# EAGLE design PCM5102a_FG_Small_1 (EAGLE 7.2.0)
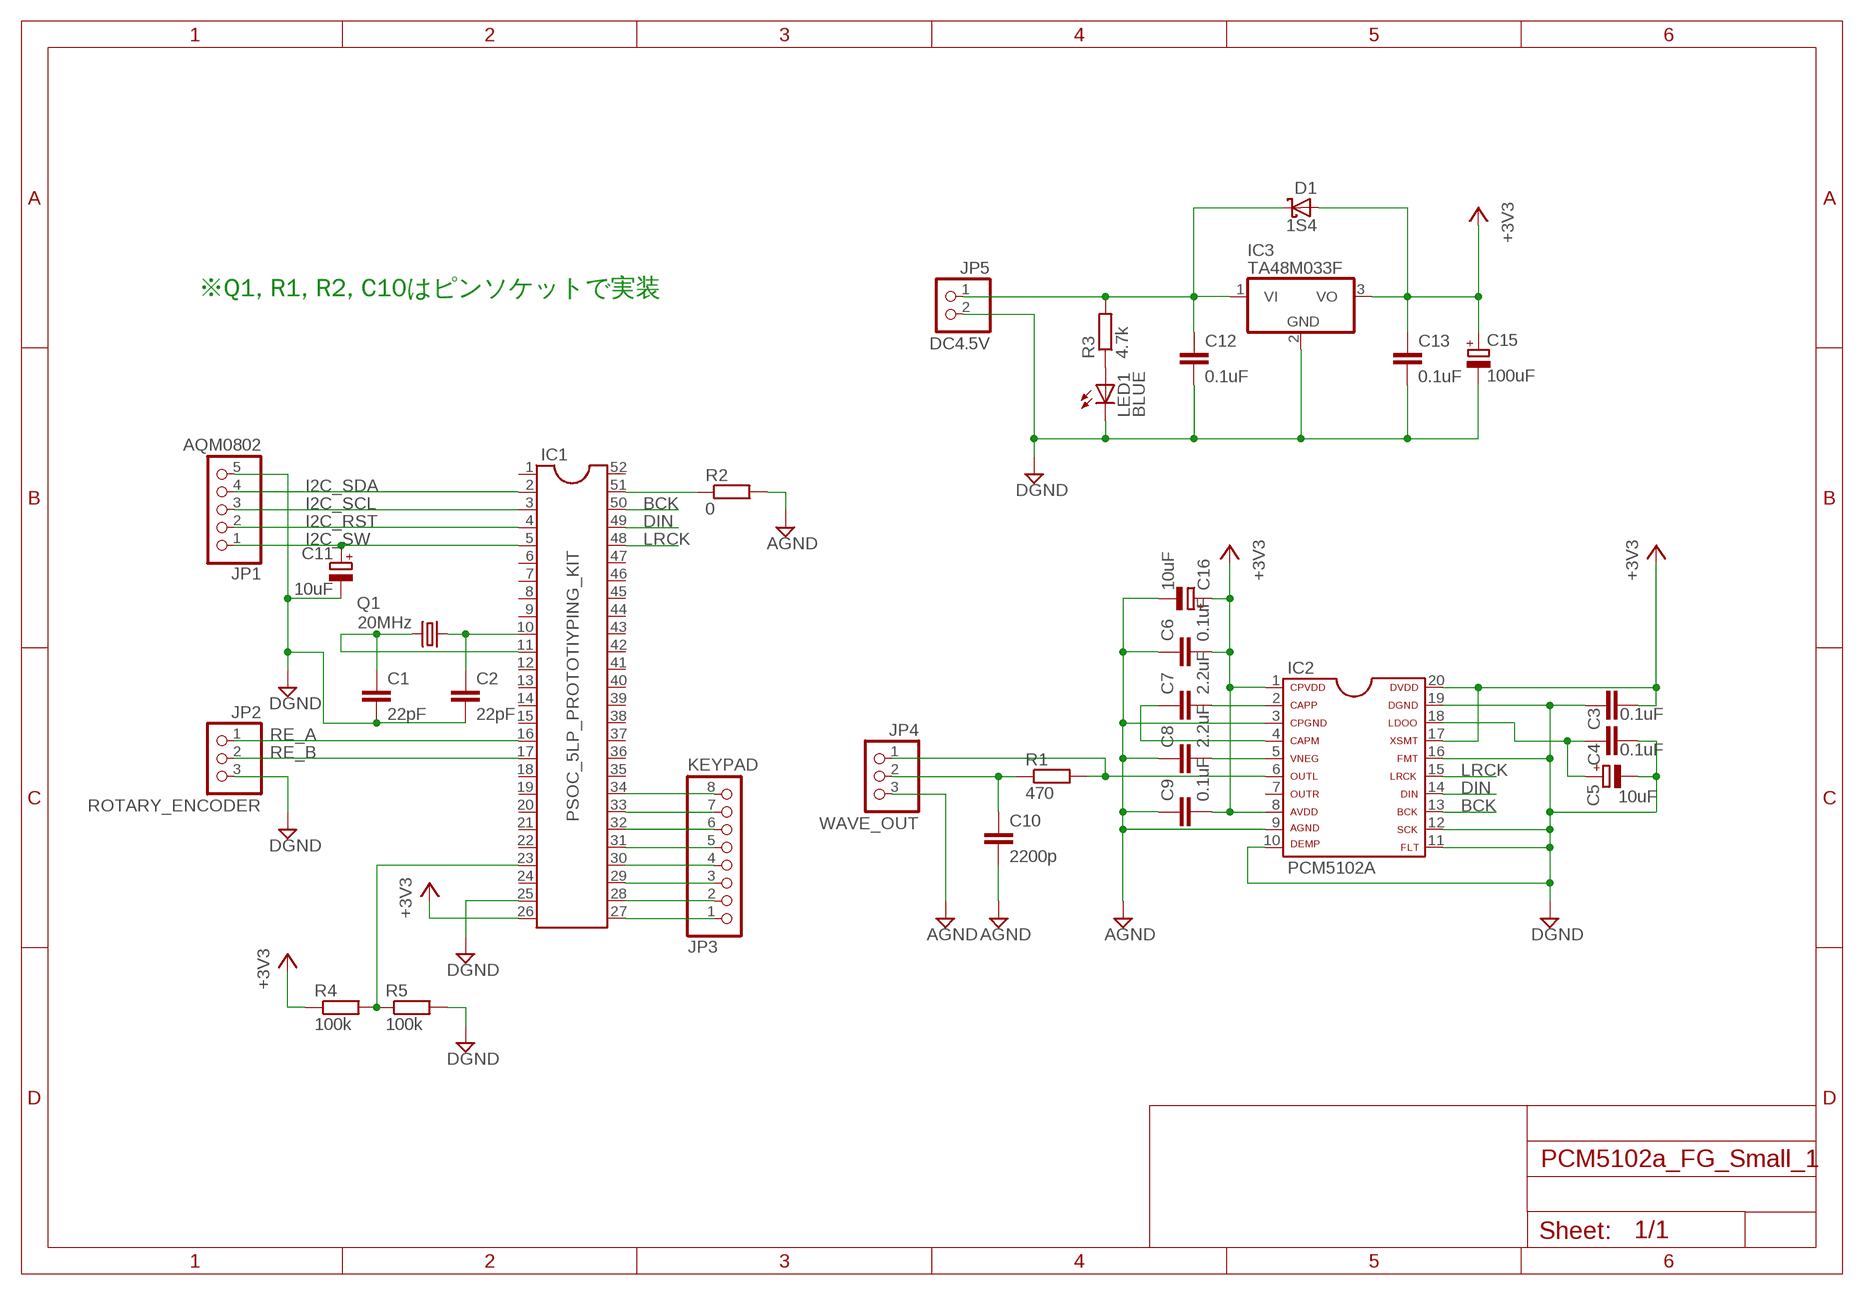
[diagram p0: schematic, sheet 1]

## Parts
C1  22pF  C-EU050-024X044  [C050-024X044]
C2  22pF  C-EU050-024X044  [C050-024X044]
C3  0.1uF  C-EU025-024X044  [C025-024X044]
C4  0.1uF  C-EU025-024X044  [C025-024X044]
C5  10uF  CPOL-EUE2.5-5  [E2,5-5]
C6  0.1uF  C-EU025-024X044  [C025-024X044]
C7  2.2uF  C-EU075-063X106  [C075-063X106]
C8  2.2uF  C-EU075-063X106  [C075-063X106]
C9  0.1uF  C-EU025-024X044  [C025-024X044]
C10  2200p  C-EU050-035X075  [C050-035X075]
C11  10uF  CPOL-EUE2.5-5  [E2,5-5]
C12  0.1uF  C-EU025-024X044  [C025-024X044]
C13  0.1uF  C-EU025-024X044  [C025-024X044]
C15  100uF  CPOL-EUE2.5-7  [E2,5-7]
C16  10uF  CPOL-EUE2.5-5  [E2,5-5]
D1  1S4  SCHOTTKY-DIODEDO35-7  [DO35-7]
IC1  PSOC_5LP_PROTOTIYPING_KIT  [DIL52-8]
IC2  PCM5102A  [DIL20-6]
IC3  TA48M033F  7805TV  [TO220V]
JP1  AQM0802  PINHD-1X5  [1X05]
JP2  ROTARY_ENCODER  PINHD-1X3  [1X03]
JP3  KEYPAD  PINHD-1X8  [1X08]
JP4  WAVE_OUT  PINHD-1X3  [1X03]
JP5  DC4.5V  PINHD-1X2  [1X02]
LED1  BLUE  LED3MM  [LED3MM]
Q1  20MHz  CRYSTALHC49S  [HC49/S]
R1  470  R-EU_0207/7  [0207/7]
R2  0  R-EU_0207/7  [0207/7]
R3  4.7k  R-EU_0207/7  [0207/7]
R4  100k  R-EU_0207/7  [0207/7]
R5  100k  R-EU_0207/7  [0207/7]

## Nets
+3V3: C3.2 C6.2 C9.2 C13.1 C15.+ C16.+ D1.A IC1.26 IC2.1 IC2.8 IC2.17 IC2.20 IC3.3(VO) R4.1
AGND: C6.1 C8.1 C9.1 C10.2 C16.- IC2.3 IC2.9 JP4.3 R2.2
BCK: IC1.50 IC2.13
DC4.5V: C12.1 D1.C IC3.1(VI) JP5.1 R3.2
DGND: C1.2 C2.2 C3.1 C4.2 C5.- C11.- C12.2 C13.2 C15.- IC1.25 IC2.10 IC2.11 IC2.12 IC2.16 IC2.19 IC3.2(GND) JP1.5 JP2.3 JP5.2 LED1.K(C) R5.2
DIN: IC1.49 IC2.14
I2C_RST: IC1.4 JP1.2
I2C_SCL: IC1.3 JP1.3
I2C_SDA: IC1.2 JP1.4
I2C_SW: C11.+ IC1.5 JP1.1
LRCK: IC1.48 IC2.15
N$1: C4.1 C5.+ IC2.18
N$3: C7.2 IC2.2
N$4: C7.1 IC2.4
N$5: C8.2 IC2.5
N$6: IC2.6 JP4.1 R1.2
N$7: C10.1 JP4.2 R1.1
N$8: IC1.27 JP3.1
N$9: IC1.28 JP3.2
N$10: IC1.29 JP3.3
N$11: IC1.30 JP3.4
N$12: IC1.31 JP3.5
N$13: IC1.32 JP3.6
N$14: IC1.33 JP3.7
N$15: IC1.34 JP3.8
N$16: C2.1 IC1.10 Q1.1
N$17: C1.1 IC1.11 Q1.2
N$18: IC1.51 R2.1
N$19: IC1.23 R4.2 R5.1
N$20: LED1.A R3.1
RE_A: IC1.16 JP2.1
RE_B: IC1.17 JP2.2
Unconnected: IC1.1 IC1.6 IC1.7 IC1.8 IC1.9 IC1.12 IC1.13 IC1.14 IC1.15 IC1.18 IC1.19 IC1.20 IC1.21 IC1.22 IC1.24 IC1.35 IC1.36 IC1.37 IC1.38 IC1.39 IC1.40 IC1.41 IC1.42 IC1.43 IC1.44 IC1.45 IC1.46 IC1.47 IC1.52 IC2.7

## Notes on the sheet
- ※Q1, R1, R2, C10はピンソケットで実装

## Library data of the parts
C1-C4 C6-C10 C12 C13 = rcl:C-EU: CAPACITOR, European symbol
C5 C11 C15 C16 = rcl:CPOL-EU: POLARIZED CAPACITOR, European symbol
D1 = diode:SCHOTTKY-DIODE: Schottky Diode
IC1 = mylib2:PSOC_5LP_PROTOTIYPING_KIT: PSoC 5LP Prototyping Kit
IC2 = mylib2:PCM5102A: PCM5102A
IC3 = linear:78*: Positive VOLTAGE REGULATOR Source: http://cache.national.com/ds/LM/LM78L05.pdf http://www.fairchildsemi.com/ds/LM/LM7805.pdf
JP1 = pinhead:PINHD-1X5: PIN HEADER
JP2 JP4 = pinhead:PINHD-1X3: PIN HEADER
JP3 = pinhead:PINHD-1X8: PIN HEADER
JP5 = pinhead:PINHD-1X2: PIN HEADER
LED1 = led:LED: LED OSRAM: - CHIPLED LG R971, LG N971, LY N971, LG Q971, LY Q971, LO R971, LY R971 LH N974, LH R974 LS Q976, LO Q976, LY Q976 LO Q996 - Hyper CHIPLED LW Q18S LB Q993, LB Q99A, LB R99A - SideLED LS A670, LO A670, LY A670, LG A670, LP A670 LB A673, LV A673, LT A673, LW A673 LH A674 LY A675 LS A676, LA A676, LO A676, LY A676, LW A676 LS A679, LY A679, LG A679 - Hyper Micro SIDELED® LS Y876, LA Y876, LO Y876, LY Y876 LT Y87S - SmartLED LW L88C, LW L88S LB L89C, LB L89S, LG L890 LS L89K, LO L89K, LY L89K LS L896, LA L896, LO L896, LY L896 - TOPLED LS T670, LO T670, LY T670, LG T670, LP T670 LSG T670, LSP T670, LSY T670, LOP T670, LYG T670 LG T671, LOG T671, LSG T671 LB T673, LV T673, LT T673, LW T673 LH T674 LS T676, LA T676, LO T676, LY T676, LB T676, LH T676, LSB T676, LW T676 LB T67C, LV T67C, LT T67C, LS T67K, LO T67K, LY T67K, LW E67C LS E67B, LA E67B, LO E67B, LY E67B, LB E67C, LV E67C, LT E67C LW T67C LS T679, LY T679, LG T679 LS T770, LO T770, LY T770, LG T770, LP T770 LB T773, LV T773, LT T773, LW T773 LH T774 LS E675, LA E675, LY E675, LS T675 LS T776, LA T776, LO T776, LY T776, LB T776 LHGB T686 LT T68C, LB T68C - Hyper Mini TOPLED® LB M676 - Mini TOPLED Santana® LG M470 LS M47K, LO M47K, LY M47K Source: http://www.osram.convergy.de LUXEON: - LUMILED® LXK2-PW12-R00, LXK2-PW12-S00, LXK2-PW14-U00, LXK2-PW14-V00 LXK2-PM12-R00, LXK2-PM12-S00, LXK2-PM14-U00 LXK2-PE12-Q00, LXK2-PE12-R00, LXK2-PE12-S00, LXK2-PE14-T00, LXK2-PE14-U00 LXK2-PB12-K00, LXK2-PB12-L00, LXK2-PB12-M00, LXK2-PB14-N00, LXK2-PB14-P00, LXK2-PB14-Q00 LXK2-PR12-L00, LXK2-PR12-M00, LXK2-PR14-Q00, LXK2-PR14-R00 LXK2-PD12-Q00, LXK2-PD12-R00, LXK2-PD12-S00 LXK2-PH12-R00, LXK2-PH12-S00 LXK2-PL12-P00, LXK2-PL12-Q00, LXK2-PL12-R00 Source: www.luxeon.com KINGBRIGHT: KA-3528ASYC Source: www.kingbright.com
Q1 = crystal:CRYSTAL: CRYSTAL; OC_FARNELL: 1667008; OC_NEWARK: unknown
R1 = rcl:R-EU_: RESISTOR, European symbol
R2-R5 = resistor:R-EU_: RESISTOR, European symbol

## Board
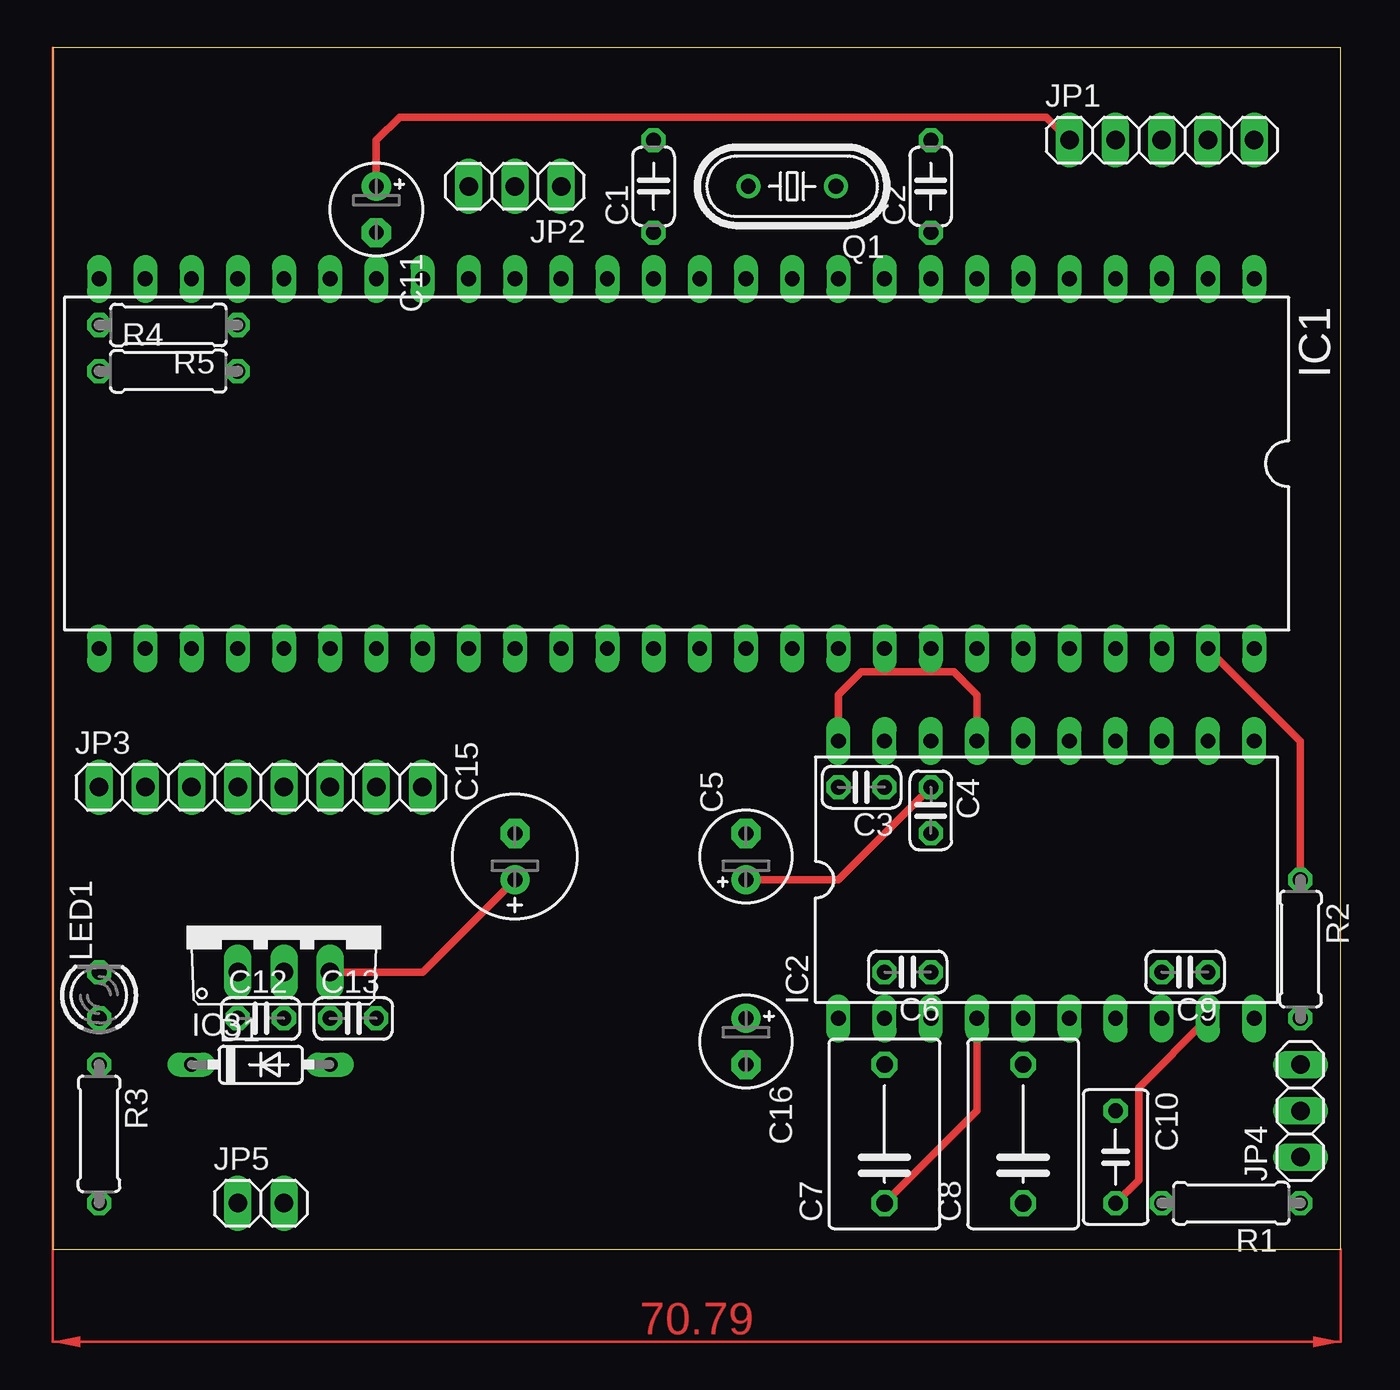
[diagram p1: board, top side]
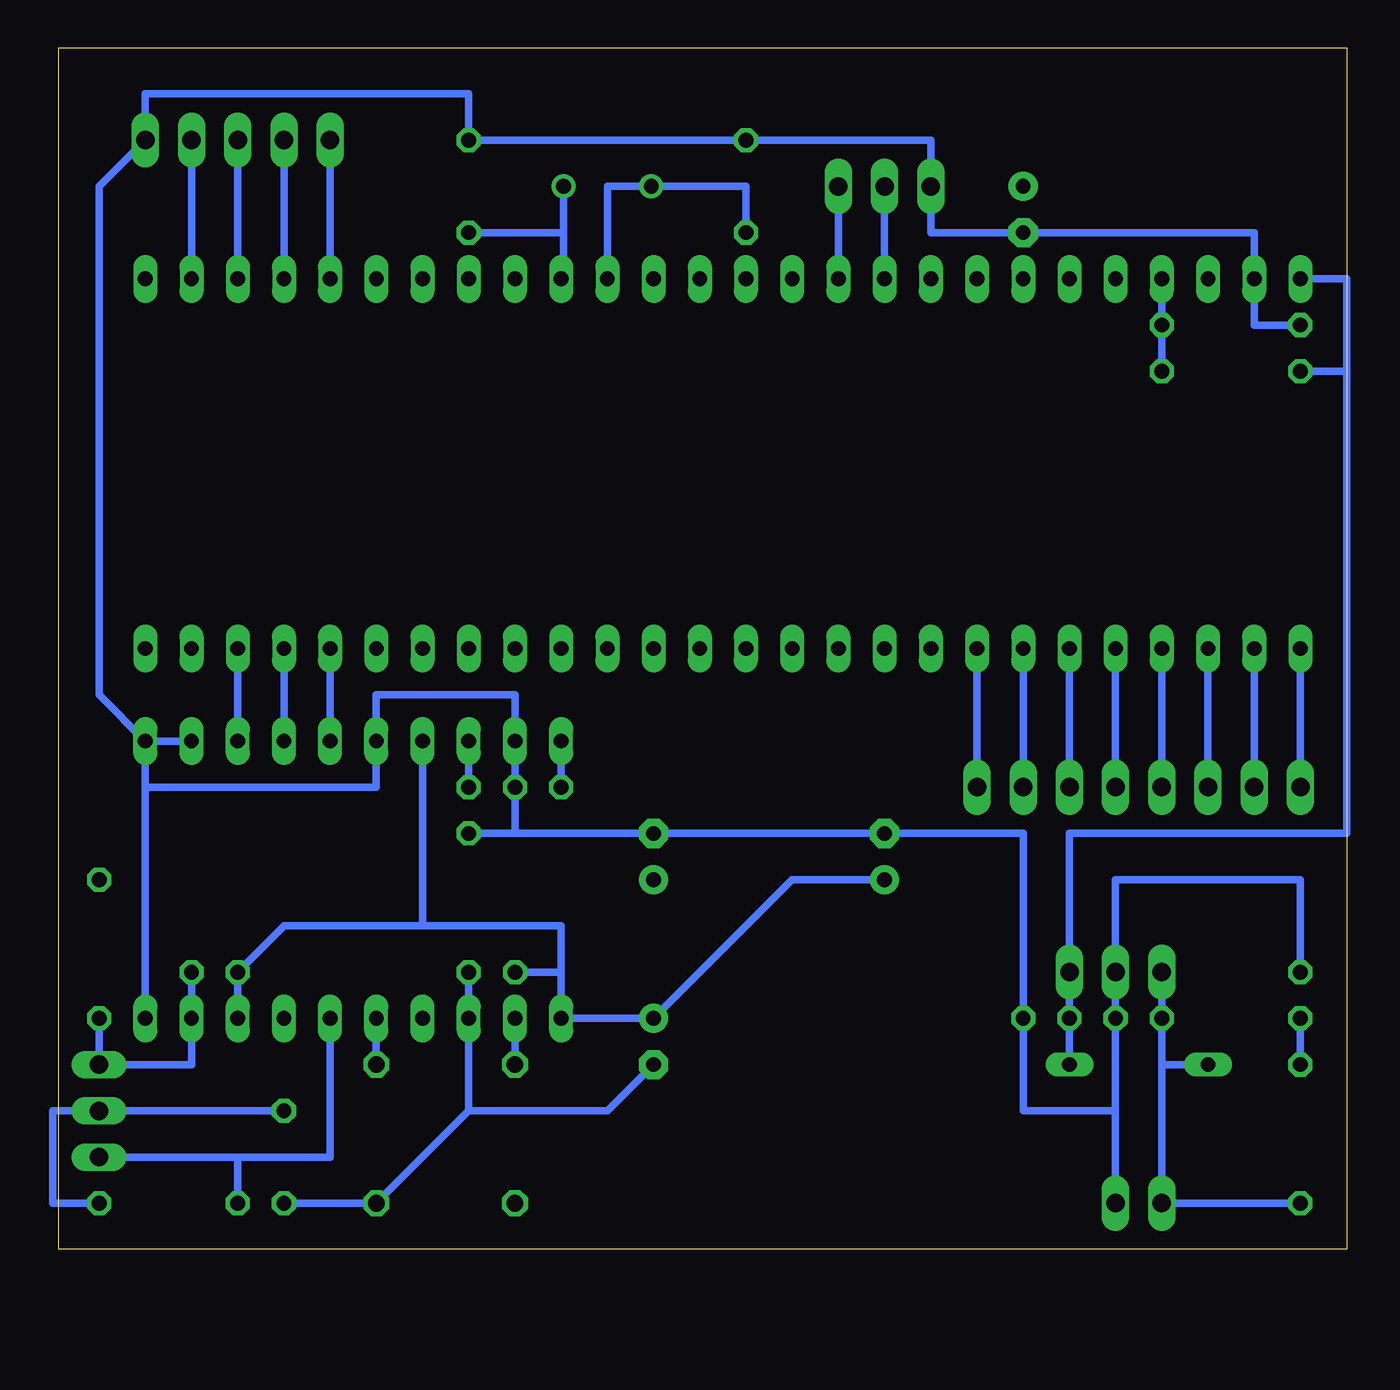
[diagram p2: board, bottom side, seen from below]

Size 70.79 x 66.03 mm. Coordinates in mm from the lower left corner, seen from the top.
Outline: 0,0 70.79,0 70.79,66.03 0,66.03 0,0
Copper layers (1*16): Top 0.035mm / dielectric 1.5mm / Bottom 0.035mm
Design rules "default": minimum track width 10mil, minimum drill 24mil, track to track 8mil, track to pad 8mil, pad to pad 8mil, via to via 8mil, smd to smd 8mil, copper to edge 40mil, drill to drill 8mil, minimum pad ring 10mil, minimum via ring 8mil, stop-mask expansion 4mil, vias tented up to drill 0mil, thermal gap 10mil
tKeepout: area 49.5,55.9 to 72.4,91.4

### Footprints (pad centres in the part's own frame; a part is rotated, then mirrored left to right if it is on the bottom)
C050-024X044 = drill 0.813 octagon: 1 -2.54,0; 2 2.54,0
C025-024X044 = drill 0.813 octagon: 1 -1.27,0; 2 1.27,0
E2,5-5 = drill 0.813 pad 1.6: + -1.27,0 | drill 0.813 pad 1.6 octagon: - 1.27,0
C075-063X106 = drill 0.914 octagon: 1 -3.81,0; 2 3.81,0
C050-035X075 = drill 0.813 octagon: 1 -2.54,0; 2 2.54,0
E2,5-7 = drill 0.813 pad 1.6: + -1.27,0 | drill 0.813 pad 1.6 octagon: - 1.27,0
DO35-7 = drill 0.813 long: A 3.81,0; C -3.81,0
DIL52-8 = drill 0.813 long: 1 -31.75,-11.43; 2 -29.21,-11.43; 3 -26.67,-11.43; 4 -24.13,-11.43; 5 -21.59,-11.43; 6 -19.05,-11.43; 7 -16.51,-11.43; 8 -13.97,-11.43; 9 -11.43,-11.43; 10 -8.89,-11.43; 11 -6.35,-11.43; 12 -3.81,-11.43; 13 -1.27,-11.43; 14 1.27,-11.43; 15 3.81,-11.43; 16 6.35,-11.43; 17 8.89,-11.43; 18 11.43,-11.43; 19 13.97,-11.43; 20 16.51,-11.43; 21 19.05,-11.43; 22 21.59,-11.43; 23 24.13,-11.43; 24 26.67,-11.43; 25 29.21,-11.43; 26 31.75,-11.43; 27 31.75,8.89; 28 29.21,8.89; 29 26.67,8.89; 30 24.13,8.89; 31 21.59,8.89; 32 19.05,8.89; 33 16.51,8.89; 34 13.97,8.89; 35 11.43,8.89; 36 8.89,8.89; 37 6.35,8.89; 38 3.81,8.89; 39 1.27,8.89; 40 -1.27,8.89; 41 -3.81,8.89; 42 -6.35,8.89; 43 -8.89,8.89; 44 -11.43,8.89; 45 -13.97,8.89; 46 -16.51,8.89; 47 -19.05,8.89; 48 -21.59,8.89; 49 -24.13,8.89; 50 -26.67,8.89; 51 -29.21,8.89; 52 -31.75,8.89
DIL20-6 = drill 0.813 long: 1 -11.43,-7.62; 2 -8.89,-7.62; 3 -6.35,-7.62; 4 -3.81,-7.62; 5 -1.27,-7.62; 6 1.27,-7.62; 7 3.81,-7.62; 8 6.35,-7.62; 9 8.89,-7.62; 10 11.43,-7.62; 11 11.43,7.62; 12 8.89,7.62; 13 6.35,7.62; 14 3.81,7.62; 15 1.27,7.62; 16 -1.27,7.62; 17 -3.81,7.62; 18 -6.35,7.62; 19 -8.89,7.62; 20 -11.43,7.62
TO220V = drill 1.016 long: 1 -2.54,-2.54; 2 0,-2.54; 3 2.54,-2.54
1X05 = drill 1.016 long: 1 -5.08,0; 2 -2.54,0; 3 0,0; 4 2.54,0; 5 5.08,0
1X03 = drill 1.016 long: 1 -2.54,0; 2 0,0; 3 2.54,0
1X08 = drill 1.016 long: 1 -8.89,0; 2 -6.35,0; 3 -3.81,0; 4 -1.27,0; 5 1.27,0; 6 3.81,0; 7 6.35,0; 8 8.89,0
1X02 = drill 1.016 long: 1 -1.27,0; 2 1.27,0
LED3MM = drill 0.813 octagon: A -1.27,0; K 1.27,0
HC49/S = drill 0.813: 1 -2.413,0; 2 2.413,0
0207/7 = drill 0.813 octagon: 1 -3.81,0; 2 3.81,0

### Placement (x,y rotation side)
C1  33.02,58.42 90 top
C2  48.26,58.42 90 top
C3  44.45,25.4 180 top
C4  48.26,24.13 270 top
C5  38.1,21.59 90 top
C6  46.99,15.24 180 top
C7  45.72,6.35 90 top
C8  53.34,6.35 90 top
C9  62.23,15.24 180 top
C10  58.42,5.08 270 top
C11  17.78,57.15 270 top
C12  11.43,12.7 0 top
C13  16.51,12.7 0 top
C15  25.4,21.59 90 top
C16  38.1,11.43 270 top
D1  11.43,10.16 0 top
IC1  34.29,41.91 180 top
IC2  54.61,20.32 0 top
IC3  12.7,17.78 0 top
JP1  60.96,60.96 0 top
JP2  25.4,58.42 180 top
JP3  11.43,25.4 0 top
JP4  68.58,7.62 90 top
JP5  11.43,2.54 0 top
LED1  2.54,13.97 90 top
Q1  40.64,58.42 180 top
R1  64.77,2.54 180 top
R2  68.58,16.51 270 top
R3  2.54,6.35 270 top
R4  6.35,48.26 0 top
R5  6.35,50.8 180 top

### Tracks (layer width: path | path; a pad name or v marks a point on that pad's centre or on a via)
+3V3
  Top 0.406: IC2.20 43.18,30.48 44.45,31.75 49.53,31.75 50.8,30.48 IC2.17 | IC3.3 20.32,15.24 C15.+
  Bottom 0.406: IC2.20 C3.2 | IC2.8 C9.2 58.42,17.78 50.8,17.78 | 0,48.26 0,22.86 15.24,22.86 IC3.3 C13.1 D1.A | C15.+ 30.48,20.32 C16.+ IC2.1 43.18,15.24 | IC2.17 50.8,17.78 | 50.8,17.78 43.18,17.78 43.18,15.24 | C6.2 43.18,15.24 | R4.1 0,48.26 | IC1.26 0,53.34 0,48.26
AGND
  Top 0.406: C10.2 59.69,3.81 59.69,8.89 IC2.9
  Bottom 0.406: C6.1 IC2.3 48.26,7.62 | C9.1 IC2.9 63.5,10.16 JP4.3 R2.2 | C16.- 40.64,7.62 48.26,7.62 | 48.26,7.62 C8.1 C10.2
BCK
  Bottom 0.406: IC1.50 IC2.13
DC4.5V
  Bottom 0.406: IC3.1 C12.1 10.16,10.16 | 10.16,10.16 JP5.1 R3.2 | D1.C 10.16,10.16
DGND
  Bottom 0.406: IC2.11 68.58,30.48 68.58,58.42 JP1.5 66.04,63.5 48.26,63.5 C2.2 C1.2 22.86,60.96 JP2.3 22.86,55.88 C11.- 5.08,55.88 IC1.25 5.08,50.8 R5.2 | 66.04,25.4 53.34,25.4 IC2.16 53.34,30.48 45.72,30.48 IC2.19 C3.1 45.72,22.86 | 12.7,7.62 17.78,7.62 C13.2 17.78,22.86 C15.- C5.- 45.72,22.86 | JP5.2 12.7,7.62 | 12.7,7.62 C12.2 IC3.2 12.7,20.32 2.54,20.32 LED1.K | IC2.10 66.04,25.4 | 66.04,25.4 IC2.11 | IC2.12 IC2.11 | 45.72,22.86 C4.2
DIN
  Bottom 0.406: IC1.49 IC2.14
I2C_RST
  Bottom 0.406: IC1.4 JP1.2
I2C_SCL
  Bottom 0.406: IC1.3 JP1.3
I2C_SDA
  Bottom 0.406: IC1.2 JP1.4
I2C_SW
  Top 0.406: C11.+ 17.78,60.96 19.05,62.23 54.61,62.23 JP1.1
  Bottom 0.406: IC1.5 JP1.1
LRCK
  Bottom 0.406: IC1.48 IC2.15
N$1
  Top 0.406: C5.+ 43.18,20.32 C4.1
  Bottom 0.406: C4.1 IC2.18
N$3
  Bottom 0.406: IC2.2 C7.2
N$4
  Top 0.406: IC2.4 50.8,7.62 C7.1
N$5
  Bottom 0.406: IC2.5 C8.2
N$6
  Bottom 0.406: IC2.6 55.88,5.08 60.96,5.08 | 60.96,5.08 R1.2 | JP4.1 60.96,5.08
N$7
  Bottom 0.406: C10.1 JP4.2 71.12,7.62 71.12,2.54 R1.1
N$8
  Bottom 0.406: IC1.27 JP3.1
N$9
  Bottom 0.406: IC1.28 JP3.2
N$10
  Bottom 0.406: IC1.29 JP3.3
N$11
  Bottom 0.406: IC1.30 JP3.4
N$12
  Bottom 0.406: IC1.31 JP3.5
N$13
  Bottom 0.406: IC1.32 JP3.6
N$14
  Bottom 0.406: IC1.33 JP3.7
N$15
  Bottom 0.406: IC1.34 JP3.8
N$16
  Bottom 0.406: Q1.1 43.05,55.88 | 43.05,55.88 43.05,53.47 IC1.10 | C2.1 43.05,55.88
N$17
  Bottom 0.406: C1.1 33.02,58.42 Q1.2 40.64,58.42 IC1.11
N$18
  Top 0.406: R2.1 68.58,27.94 IC1.51
N$19
  Bottom 0.406: IC1.23 R5.1 R4.2
N$20
  Bottom 0.406: R3.1 LED1.A
RE_A
  Bottom 0.406: IC1.16 JP2.1
RE_B
  Bottom 0.406: IC1.17 JP2.2
(copper drawn outside any net)
  shapes: Top area x2